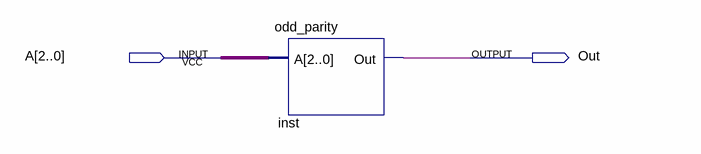
[diagram p0: schematic sheet]
// Quartus schematic Top_Level.bdf as structural Verilog: 1 symbols, 2 pins
module Top_Level (
  input  [2:0] A,
  output Out
);

  odd_parity inst (.A(A), .Out(Out));
endmodule
